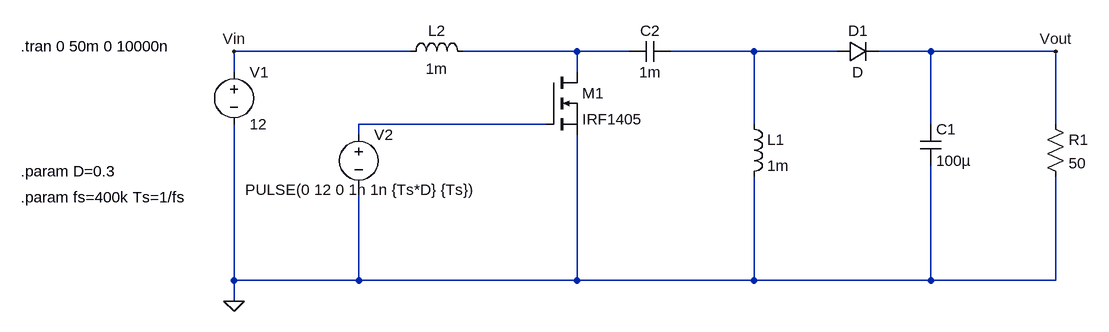
[diagram p0: schematic Convertor_SEPIC.asc]
Convertor_SEPIC.asc, the LTspice schematic file:
Version 4
SHEET 1 900 680
WIRE -160 112 -432 112
WIRE 96 112 -80 112
WIRE 176 112 96 112
WIRE 368 112 240 112
WIRE 496 112 368 112
WIRE 640 112 560 112
WIRE 832 112 640 112
WIRE -432 144 -432 112
WIRE 96 144 96 112
WIRE 48 224 -240 224
WIRE 368 224 368 112
WIRE 640 224 640 112
WIRE 832 224 832 112
WIRE -240 240 -240 224
WIRE -432 464 -432 224
WIRE -240 464 -240 320
WIRE -240 464 -432 464
WIRE 96 464 96 240
WIRE 96 464 -240 464
WIRE 368 464 368 304
WIRE 368 464 96 464
WIRE 640 464 640 288
WIRE 640 464 368 464
WIRE 832 464 832 304
WIRE 832 464 640 464
WIRE -432 496 -432 464
FLAG -432 496 0
FLAG -432 112 Vin
FLAG 832 112 Vout
SYMBOL nmos 48 144 R0
SYMATTR InstName M1
SYMATTR Value IRF1405
SYMBOL cap 624 224 R0
SYMATTR InstName C1
SYMATTR Value 100µ
SYMBOL res 816 208 R0
SYMATTR InstName R1
SYMATTR Value 50
SYMBOL voltage -432 128 R0
WINDOW 123 0 0 Left 0
WINDOW 39 0 0 Left 0
SYMATTR InstName V1
SYMATTR Value 12
SYMBOL voltage -240 224 R0
WINDOW 123 0 0 Left 0
WINDOW 39 0 0 Left 0
WINDOW 3 -175 101 Left 2
SYMATTR Value PULSE(0 12 0 1n 1n {Ts*D} {Ts})
SYMATTR InstName V2
SYMBOL ind -176 128 R270
WINDOW 0 32 56 VTop 2
WINDOW 3 5 56 VBottom 2
SYMATTR InstName L2
SYMATTR Value 1m
SYMBOL cap 240 96 R90
WINDOW 0 0 32 VBottom 2
WINDOW 3 32 32 VTop 2
SYMATTR InstName C2
SYMATTR Value 1m
SYMBOL ind 352 208 R0
SYMATTR InstName L1
SYMATTR Value 1m
SYMBOL diode 496 128 R270
WINDOW 0 32 32 VTop 2
WINDOW 3 0 32 VBottom 2
SYMATTR InstName D1
TEXT -760 104 Left 2 !.tran 0 50m 0 10000n
TEXT -760 296 Left 2 !.param D=0.3
TEXT -760 336 Left 2 !.param fs=400k Ts=1/fs

The netlist it stands for:
* Convertor_SEPIC.asc
M1 N001 N003 0 0 IRF1405
C1 Vout 0 100µ
R1 Vout 0 50
V1 Vin 0 12
V2 N003 0 PULSE(0 12 0 1n 1n {Ts*D} {Ts})
L2 Vin N001 1m
C2 N002 N001 1m
L1 N002 0 1m
D1 N002 Vout D
.model D D
.lib standard.dio
.model NMOS NMOS
.model PMOS PMOS
.lib standard.mos
.tran 0 50m 0 10000n
.param D=0.3
.param fs=400k Ts=1/fs
.backanno
.end